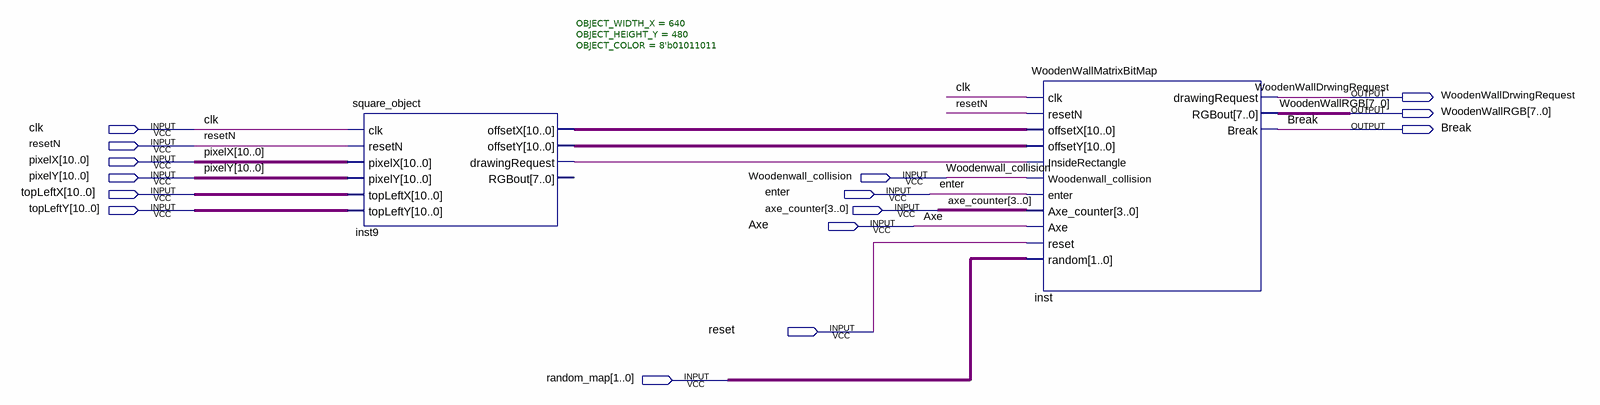
[diagram p0: schematic sheet]
// Quartus schematic WOODENWALL_DISPLAY.bdf as structural Verilog: 2 symbols, 15 pins
module WOODENWALL_DISPLAY (
  input  clk,
  input  resetN,
  input  [10:0] pixelX,
  input  [10:0] pixelY,
  input  Woodenwall_collision,
  input  [10:0] topLeftX,
  input  enter,
  input  [10:0] topLeftY,
  input  [3:0] axe_counter,
  input  Axe,
  input  reset,
  input  [1:0] random_map,
  output WoodenWallDrwingRequest,
  output [7:0] WoodenWallRGB,
  output Break
);

  wire inst9_drawingrequest;
  wire [10:0] inst9_offsetx, inst9_offsety;

  square_object #(.OBJECT_WIDTH_X(640), .OBJECT_HEIGHT_Y(480), .OBJECT_COLOR(8'b01011011)) inst9 (
    .clk(clk), .resetN(resetN), .pixelX(pixelX), .pixelY(pixelY), .topLeftX(topLeftX), .topLeftY(topLeftY),
    .offsetX(inst9_offsetx), .offsetY(inst9_offsety), .drawingRequest(inst9_drawingrequest));  // open: RGBout
  WoodenWallMatrixBitMap inst (
    .clk(clk), .resetN(resetN), .offsetX(inst9_offsetx), .offsetY(inst9_offsety),
    .InsideRectangle(inst9_drawingrequest), .Woodenwall_collision(Woodenwall_collision), .enter(enter),
    .Axe_counter(axe_counter), .Axe(Axe), .reset(reset), .random(random_map),
    .drawingRequest(WoodenWallDrwingRequest), .RGBout(WoodenWallRGB), .Break(Break));
endmodule
